# Altium project DBG-020.PrjPcb
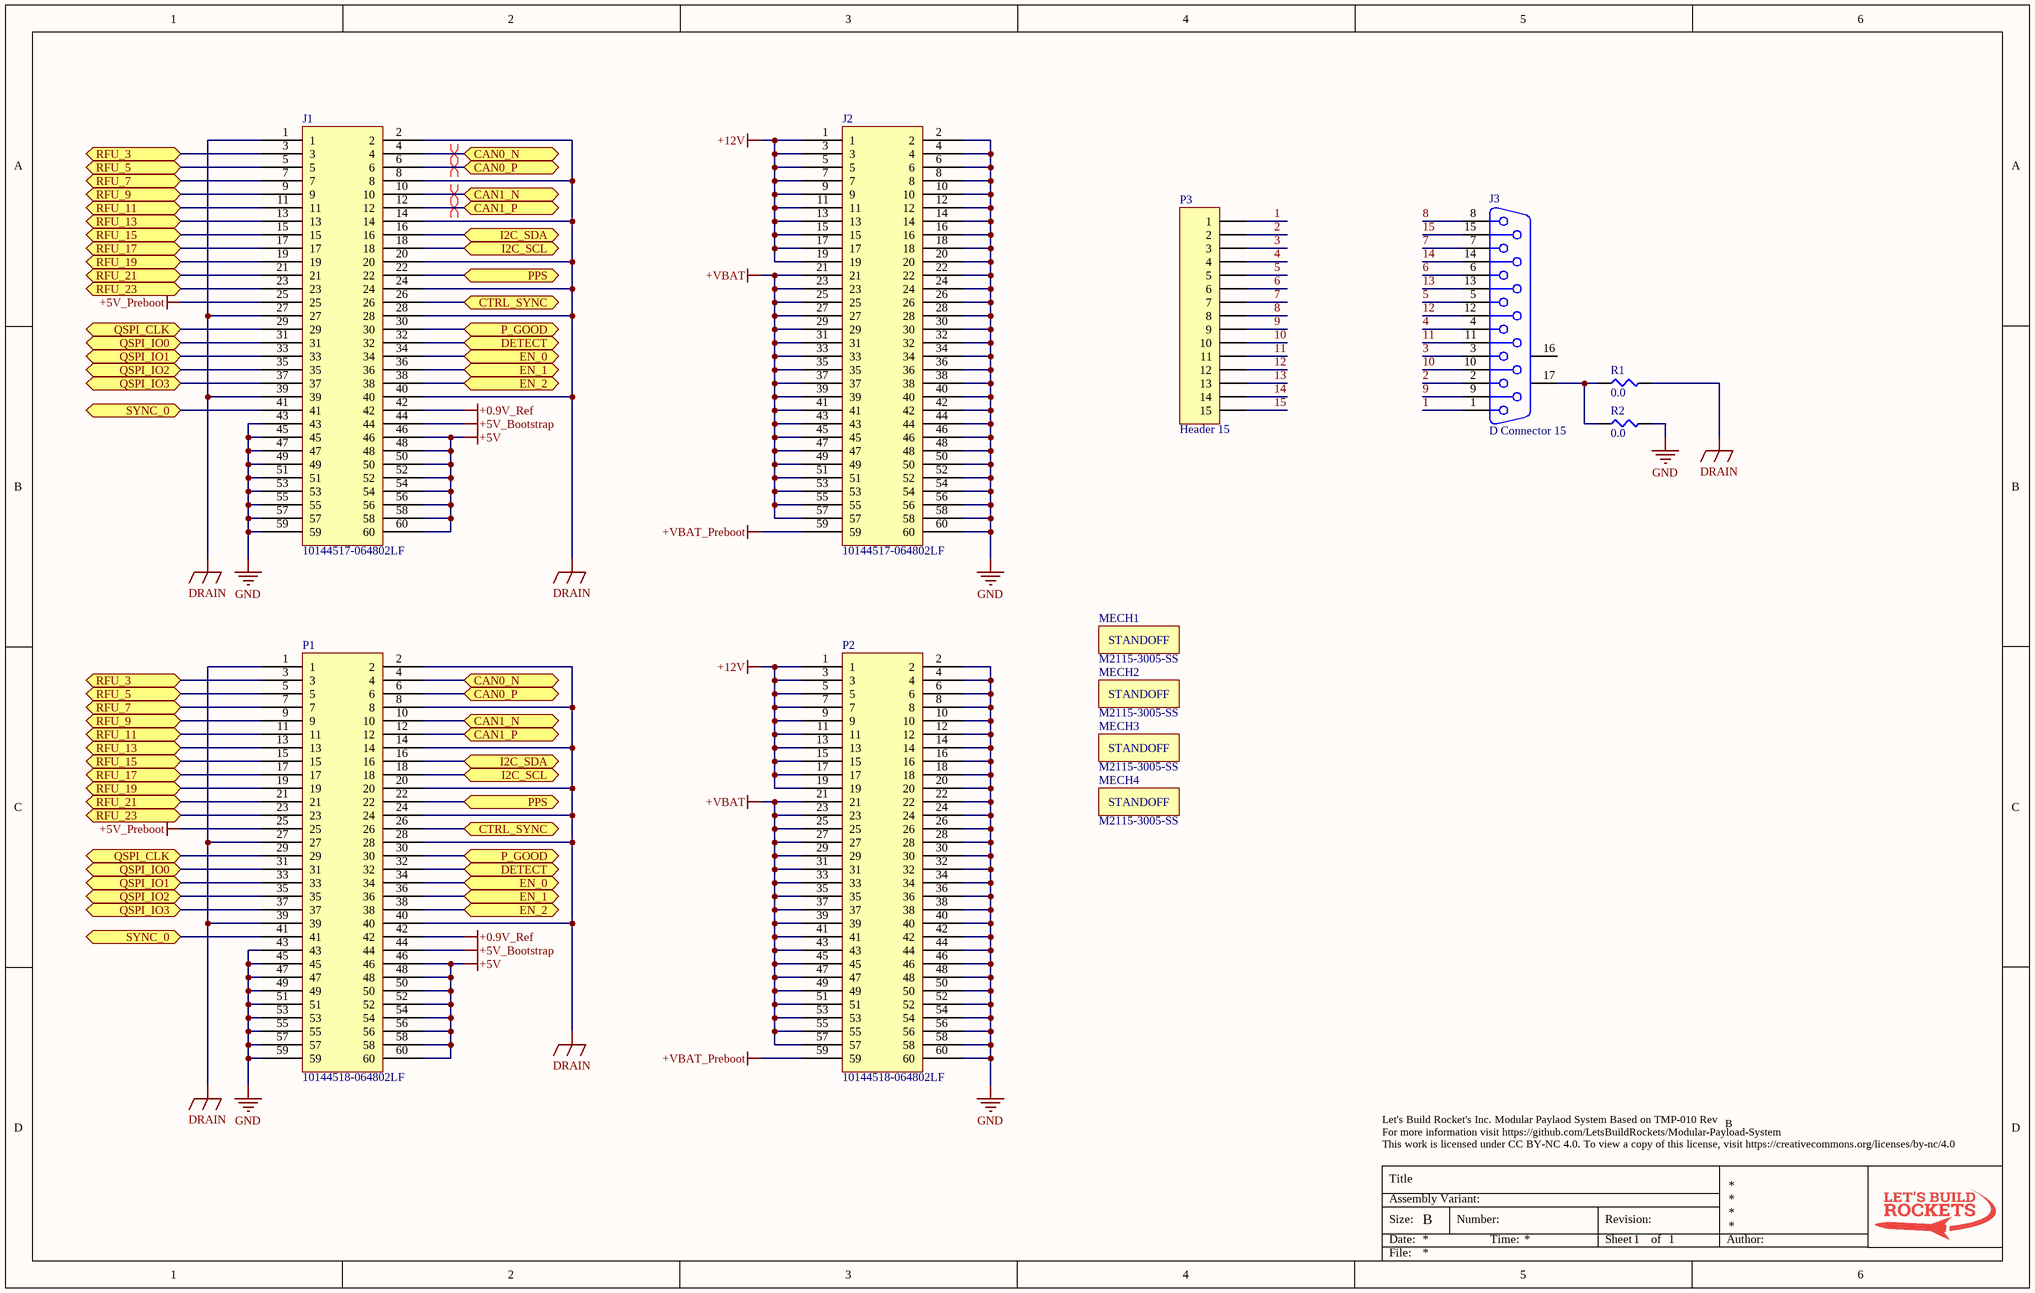
[diagram p0: Sheet1.SchDoc]
TemplateRevision: B; ProjectTitle: Pogo Pin TP Module; ProjectRevision: A; ProjectOrganization: Let's Build Rockets Inc.; ProjectDocumentNumber: DBG-020; ProjectAuthor: E. Sims
1 sheet, 12 parts. Net scope: flat (ports and power ports of the same name join across sheets).
Board file: DBG-020.PcbDoc

## Sheet Sheet1.SchDoc: =ProjectTitle
size B; Author: E. Sims; Organization: Let's Build Rockets Inc.; DocumentNumber: DBG-020; Revision: A; SheetNumber: 1; SheetTotal: 1

### Parts
J1  10144517-064802LF  [10144517-064802LF]
J2  10144517-064802LF  [10144517-064802LF]
J3  D Connector 15  [DSUB1.385-2H15]
MECH1  M2115-3005-SS  [M2115-3005-SS]
MECH2  M2115-3005-SS  [M2115-3005-SS]
MECH3  M2115-3005-SS  [M2115-3005-SS]
MECH4  M2115-3005-SS  [M2115-3005-SS]
P1  10144518-064802LF  [10144518-064802LF]
P2  10144518-064802LF  [10144518-064802LF]
P3  Header 15  [HDR1X15]
R1  0.0  [SMD-0402-RES]
R2  0.0  [SMD-0402-RES]

### Ports
CAN0_N (bidir), CAN0_P (bidir), CAN1_N (bidir), CAN1_P (bidir), CTRL_SYNC (bidir), DETECT (bidir), EN_0 (bidir), EN_1 (bidir), EN_2 (bidir), I2C_SCL (bidir), I2C_SDA (bidir), P_GOOD (bidir), PPS (bidir), QSPI_CLK (bidir), QSPI_IO0 (bidir), QSPI_IO1 (bidir), QSPI_IO2 (bidir), QSPI_IO3 (bidir), RFU_3 (bidir), RFU_5 (bidir), RFU_7 (bidir), RFU_9 (bidir), RFU_11 (bidir), RFU_13 (bidir), RFU_15 (bidir), RFU_17 (bidir), RFU_19 (bidir), RFU_21 (bidir), RFU_23 (bidir), SYNC_0 (bidir)

### Nets
+0.9V_Ref: J1.42 P1.42
+5V: J1.46 J1.48 J1.50 J1.52 J1.54 J1.56 J1.58 J1.60 P1.46 P1.48 P1.50 P1.52 P1.54 P1.56 P1.58 P1.60
+5V_Bootstrap: J1.44 P1.44
+5V_Preboot: J1.25 P1.25
+12V: J2.1 J2.3 J2.5 J2.7 J2.9 J2.11 J2.13 J2.15 J2.17 J2.19 P2.1 P2.3 P2.5 P2.7 P2.9 P2.11 P2.13 P2.15 P2.17 P2.19
+VBAT: J2.21 J2.23 J2.25 J2.27 J2.29 J2.31 J2.33 J2.35 J2.37 J2.39 J2.41 J2.43 J2.45 J2.47 J2.49 J2.51 J2.53 J2.55 J2.57 P2.21 P2.23 P2.25 P2.27 P2.29 P2.31 P2.33 P2.35 P2.37 P2.39 P2.41 P2.43 P2.45 P2.47 P2.49 P2.51 P2.53 P2.55 P2.57
+VBAT_Preboot: J2.59 P2.59
DRAIN: J1.1 J1.2 J1.8 J1.14 J1.20 J1.24 J1.27 J1.28 J1.39 J1.40 P1.1 P1.2 P1.8 P1.14 P1.20 P1.24 P1.27 P1.28 P1.39 P1.40 R1.2
GND: J1.43 J1.45 J1.47 J1.49 J1.51 J1.53 J1.55 J1.57 J1.59 J2.2 J2.4 J2.6 J2.8 J2.10 J2.12 J2.14 J2.16 J2.18 J2.20 J2.22 J2.24 J2.26 J2.28 J2.30 J2.32 J2.34 J2.36 J2.38 J2.40 J2.42 J2.44 J2.46 J2.48 J2.50 J2.52 J2.54 J2.56 J2.58 J2.60 P1.43 P1.45 P1.47 P1.49 P1.51 P1.53 P1.55 P1.57 P1.59 P2.2 P2.4 P2.6 P2.8 P2.10 P2.12 P2.14 P2.16 P2.18 P2.20 P2.22 P2.24 P2.26 P2.28 P2.30 P2.32 P2.34 P2.36 P2.38 P2.40 P2.42 P2.44 P2.46 P2.48 P2.50 P2.52 P2.54 P2.56 P2.58 P2.60 R2.2
1: J3.1 P3.1
2: J3.2 P3.2
3: J3.3 P3.3
4: J3.4 P3.4
5: J3.5 P3.5
6: J3.6 P3.6
7: J3.7 P3.7
8: J3.8 P3.8
9: J3.9 P3.9
10: J3.10 P3.10
11: J3.11 P3.11
12: J3.12 P3.12
13: J3.13 P3.13
14: J3.14 P3.14
15: J3.15 P3.15
CAN0_N: J1.4 P1.4 ; port CAN0_N
CAN0_P: J1.6 P1.6 ; port CAN0_P
CAN1_N: J1.10 P1.10 ; port CAN1_N
CAN1_P: J1.12 P1.12 ; port CAN1_P
CTRL_SYNC: J1.26 P1.26 ; port CTRL_SYNC
DETECT: J1.32 P1.32 ; port DETECT
EN_0: J1.34 P1.34 ; port EN_0
EN_1: J1.36 P1.36 ; port EN_1
EN_2: J1.38 P1.38 ; port EN_2
I2C_SCL: J1.18 P1.18 ; port I2C_SCL
I2C_SDA: J1.16 P1.16 ; port I2C_SDA
P_GOOD: J1.30 P1.30 ; port P_GOOD
PPS: J1.22 P1.22 ; port PPS
QSPI_CLK: J1.29 P1.29 ; port QSPI_CLK
QSPI_IO0: J1.31 P1.31 ; port QSPI_IO0
QSPI_IO1: J1.33 P1.33 ; port QSPI_IO1
QSPI_IO2: J1.35 P1.35 ; port QSPI_IO2
QSPI_IO3: J1.37 P1.37 ; port QSPI_IO3
RFU_3: J1.3 P1.3 ; port RFU_3
RFU_5: J1.5 P1.5 ; port RFU_5
RFU_7: J1.7 P1.7 ; port RFU_7
RFU_9: J1.9 P1.9 ; port RFU_9
RFU_11: J1.11 P1.11 ; port RFU_11
RFU_13: J1.13 P1.13 ; port RFU_13
RFU_15: J1.15 P1.15 ; port RFU_15
RFU_17: J1.17 P1.17 ; port RFU_17
RFU_19: J1.19 P1.19 ; port RFU_19
RFU_21: J1.21 P1.21 ; port RFU_21
RFU_23: J1.23 P1.23 ; port RFU_23
SYNC_0: J1.41 P1.41 ; port SYNC_0
NetJ3_17: J3.17(MH2) R1.1 R2.1

Not connected (* = marked no-connect by the designer): J3 16(MH1)

### Layout directives
differential pair: CAN0_N, CAN0_P, CAN1_N, CAN1_P

### Notes on the sheet
- Let's Build Rocket's Inc. Modular Paylaod System Based on TMP-010 Rev
  For more information visit https://github.com/LetsBuildRockets/Modular-Payload-System
  This work is licensed under CC BY-NC 4.0. To view a copy of this license, visit https://creativecommons.org/licenses/by-nc/4.0
- Title
- Size:
- Date:
- Assembly Variant:
- B
- Number:
- Time:
- Revision:
- Sheet
- of
- Author:
- File:
- (in symbol M2115-3005-SS) STANDOFF

### Library data of the parts
J1 J2 = 10144517-064802LF: Unit Price (USD): 1.95
J3 = D Connector 15: Receptacle Assembly, 15 Position, Right Angle; PackageDocument: O; Positions: 15; Published: 15-Jun-2001; LatestRevisionDate: 17-Jul-2002; LatestRevisionNote: Re-released for DXP Platform.; DatasheetDocument: 1-Sep-99; PackageReference: 788757; Publisher: Altium Limited; Orientation: Right Angle; Gender: Receptacle
MECH1-MECH4 = M2115-3005-SS: Unit Price (USD): 1.81
P1 P2 = 10144518-064802LF: Unit Price (USD): 1.52
P3 = Header 15: Header, 15-Pin; LatestRevisionDate: 17-Jul-2002; LatestRevisionNote: Re-released for DXP Platform.; Publisher: Altium Limited
R1 R2 = ERJ-2GE0R00X: RES SMD 0.0OHM JUMPER 1/10W 0402; Manufacturer: Panasonic Electronic Components; Factory Stock: 0; Unit Price (USD): 0.00384; @ qty: 1500; Minimum Quantity: 1; Power (Watts): 0.1W, 1/10W; Part Number: ERJ-2GE0R00X; Datasheets: http://industrial.panasonic.com/www-cgi/jvcr13pz.cgi?E+PZ+3+AOA0001+ERJ2GE0R00X+7+WW; Image: //media.digikey.com/Photos/Panasonic%20Photos/ERJ-PA2-Series.jpg; Digi-Key Part Number: P0.0JCT-ND; Quantity Available: 3152483; Packaging: Cut Tape (CT); Series: ERJ; Part Status: Active; Value: 0.0; Tolerance: Jumper; Composition: Thick Film; Features: Automotive AEC-Q200; Temperature Coefficient: -; Operating Temperature: -55°C ~ 155°C; Package / Case: 0402 (1005 Metric); Supplier Device Package: 0402; Size / Dimension: 0.039" L x 0.020" W (1.00mm x 0.50mm); Height - Seated (Max): 0.016" (0.40mm); Number of Terminations: 2; Failure Rate: -

## Assembly variants
DBG-021: not fitted R1 R1 R2